# Altium schematic sheet Peripherals.SchDoc: Peripherals
size A4; Date: 9/24/2014; Author: P.A.; CompanyName: STMicroelectronics; Organization: Microcontrollers Division; Address1: 12, Rue Jules HOROWITZ; Address2: 38019 Grenoble; Address3: FRANCE; DocumentNumber: MB1189; Revision: B-07; SheetNumber: 5; SheetTotal: 12; Project: STM32F469I-DISCO
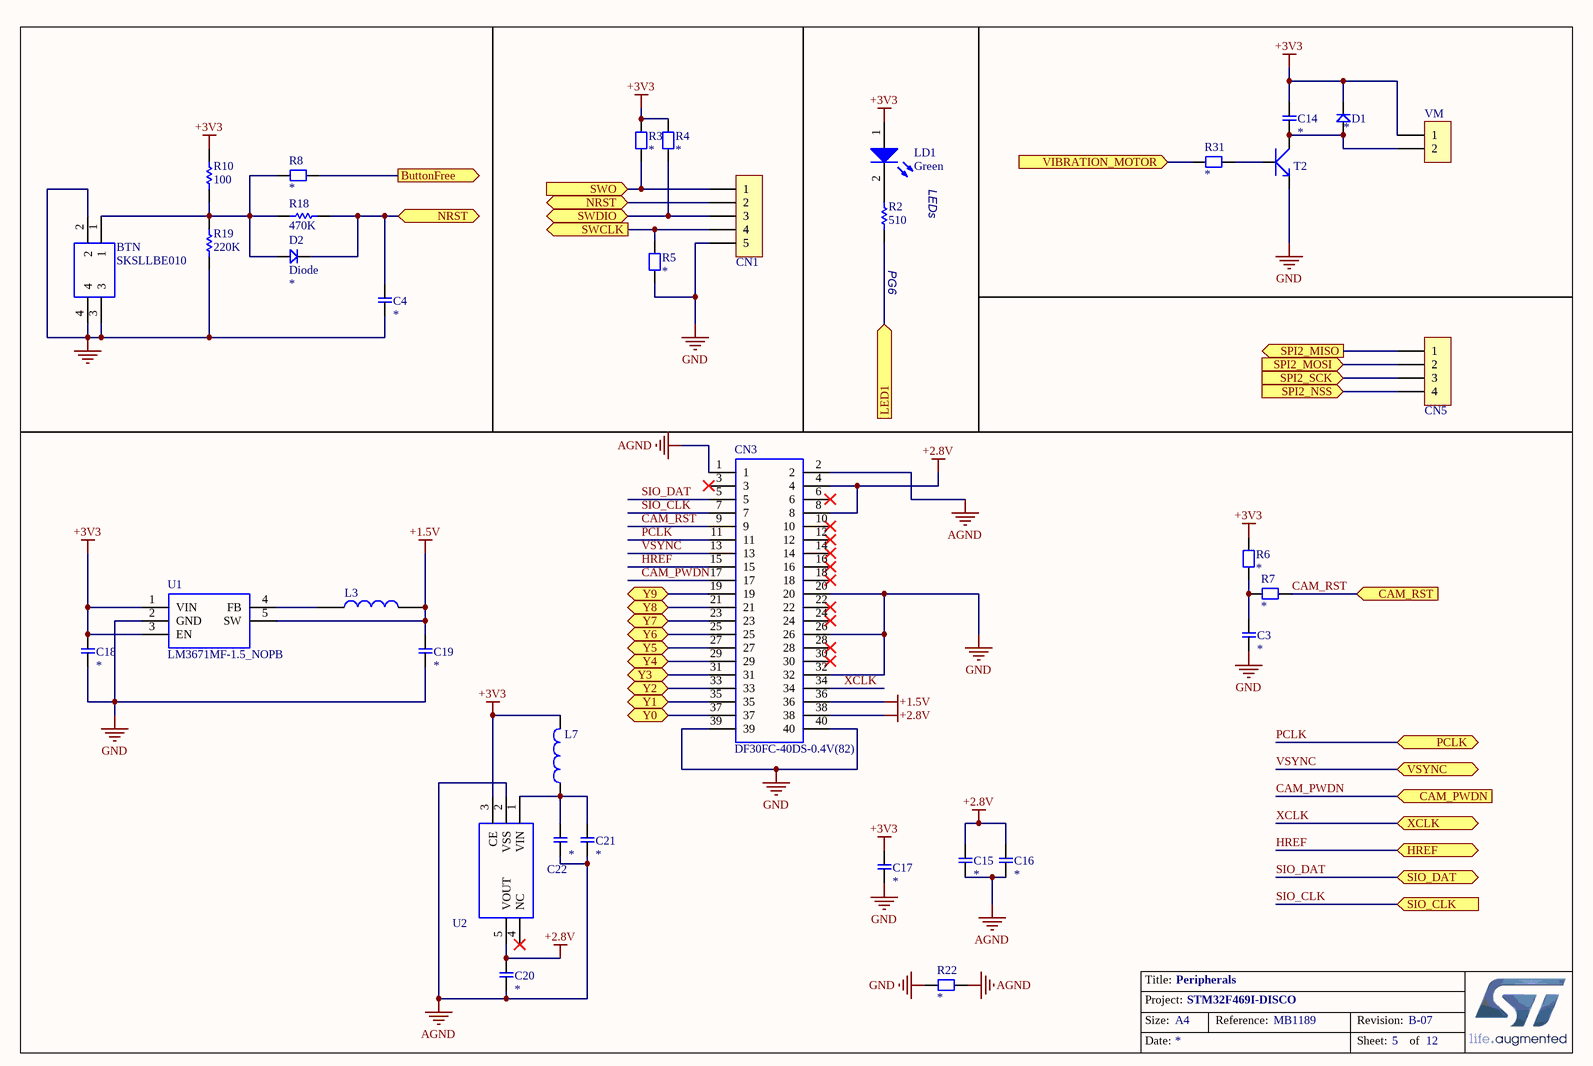
[diagram p0: Peripherals.SchDoc]

## Parts
BTN  SKSLLBE010  [SKSLLBE010]
C3  100 nF  [CAP - 0402]  (value not drawn)
C4  10uF  [CAP - 0805]  (value not drawn)
C14  100nF  [CAP - 0402]  (value not drawn)
C15  100nF  [CAP - 0402]  (value not drawn)
C16  100nF  [CAP - 0402]  (value not drawn)
C17  100nF  [CAP - 0402]  (value not drawn)
C18  4.7 uF  [CAP - 0603]  (value not drawn)
C19  10 uF  [CAP - 0402]  (value not drawn)
C20  1uF  [CAP - 0402]  (value not drawn)
C21  100nF  [CAP - 0402]  (value not drawn)
C22  10uF  [CAP - 0402]  (value not drawn)
CN1  Pin header 5p  [PIN HEADER 5P 2.54mm]  (value not drawn)
CN3  DF30FC-40DS-0.4V(82)  [DF30FC40DS04V82]
CN5  Pin header 4p  [Pin header 4p 1.27mm]  (value not drawn)
D1  Diode  [SOD123]  (value not drawn)
D2  Diode  [SOD123]
L3  2.2uH  [INDPM4532X280N]  (value not drawn)
L7  BEAD(BK1608HS600-T)  [1608[0603]]  (value not drawn)
LD1  Green  [LEDC1608X55N]
R2  510  [RES - 0402]
R3  4K7  [RES - 0402]  (value not drawn)
R4  4K7  [RES - 0402]  (value not drawn)
R5  47K  [RES - 0402]  (value not drawn)
R6  4K7  [RES - 0402]  (value not drawn)
R7  0R  [RES - 0402]  (value not drawn)
R8  10  [RES - 0402]  (value not drawn)
R10  100  [RES - 0402]
R18  470K  [RES - 0603]
R19  220K  [RES - 0402]
R22  0R  [RES - 0402]  (value not drawn)
R31  1K  [RES - 0402]  (value not drawn)
T2  BC817  [SOT23]  (value not drawn)
U1  LM3671MF-1.5_NOPB  [SOT95P280X145-5N]
U2  AP7365-28WG-7DICT-ND  [SOT95P280X120-5N]  (value not drawn)
VM  Pin header 2p  [RES - 0603]  (value not drawn)

## Ports
ButtonFree (out), CAM_PWDN (in), CAM_RST (in), HREF, LED1 (in), NRST (bidir), PCLK, SIO_CLK (in), SIO_DAT (bidir), SPI2_MISO (out), SPI2_MOSI (in), SPI2_NSS (in), SPI2_SCK (in), SWCLK (out), SWDIO (bidir), SWO (in), VIBRATION_MOTOR (in), VSYNC, XCLK, Y0, Y1, Y2, Y3, Y4, Y5, Y6, Y7, Y8, Y9

## Nets
+1.5V: C19.2 CN3.36 L3.2 U1.5(SW)
+2.8V: C15.1 C16.1 C20.1 CN3.4 CN3.8 CN3.38 U2.5(VOUT)
+3V3: C14.2 C17.1 C18.2 D1.2 L7.2 LD1.1(A) R3.2 R4.2 R6.2 R10.2 U1.1(VIN) U1.3(EN) U2.3(CE) VM.1
AGND: C15.2 C16.2 C20.2 C21.2 C22.2 CN3.1 CN3.2 R22.1 U2.2(VSS)
GND: BTN.2 BTN.3 BTN.4 C3.2 C4.1 C17.2 C18.1 C19.1 CN1.5 CN3.20 CN3.26 CN3.32 CN3.39 CN3.40 R5.1 R19.2 R22.2 T2.2 U1.2(GND)
ButtonFree: R8.2 ; port ButtonFree
CAM_PWDN: CN3.17 ; port CAM_PWDN
CAM_RST: CN3.9 R7.1 ; port CAM_RST
HREF: CN3.15 ; port HREF
LED1: R2.1 ; port LED1
NRST: C4.2 CN1.2 D2.2 R18.2 ; port NRST
PCLK: CN3.11 ; port PCLK
SIO_CLK: CN3.7 ; port SIO_CLK
SIO_DAT: CN3.5 ; port SIO_DAT
SPI2_MISO: CN5.1 ; port SPI2_MISO
SPI2_MOSI: CN5.2 ; port SPI2_MOSI
SPI2_NSS: CN5.4 ; port SPI2_NSS
SPI2_SCK: CN5.3 ; port SPI2_SCK
SWCLK: CN1.4 R5.2 ; port SWCLK
SWDIO: CN1.3 R4.1 ; port SWDIO
SWO: CN1.1 R3.1 ; port SWO
VIBRATION_MOTOR: R31.2 ; port VIBRATION_MOTOR
VSYNC: CN3.13 ; port VSYNC
XCLK: CN3.34 ; port XCLK
Y0: CN3.37 ; port Y0
Y1: CN3.35 ; port Y1
Y2: CN3.33 ; port Y2
Y3: CN3.31 ; port Y3
Y4: CN3.29 ; port Y4
Y5: CN3.27 ; port Y5
Y6: CN3.25 ; port Y6
Y7: CN3.23 ; port Y7
Y8: CN3.21 ; port Y8
Y9: CN3.19 ; port Y9
NetBTN_1: BTN.1 D2.1 R8.1 R10.1 R18.1 R19.1
NetC3_1: C3.1 R6.1 R7.2
NetC14_1: C14.1 D1.1 T2.3 VM.2
NetC21_1: C21.1 C22.1 L7.1 U2.1(VIN)
NetL3_1: L3.1 U1.4(FB)
NetLD1_2: LD1.2(K) R2.2
NetR31_1: R31.1 T2.1

Not connected (* = marked no-connect by the designer): CN3 3* 6* 10* 12* 14* 16* 18* 22* 24* 28* 30*; U2 4(NC)*

## Notes on the sheet
- LEDs
- (near R2) PG6
- Title:
- Project:
- Size:
- Date:
- A4
- Reference:
- Sheet:
- Revision:
- of

## Library data of the parts
BTN = SKSLLBE010: Black Button Tactile Switch, SPST-NO 50 mA 0.5mm Surface Mount; Manufacturer_Name: ALPS; Geometry.Height: 2mm; Mouser Part Number: 688-SKSLLBE010; Manufacturer_Part_Number: SKSLLBE010; Datasheet Link: https://componentsearchengine.com/Datasheets/1/SKSLLBE010.pdf
C3 C4 C14-C22 = capacitor: Parameter 1: *; Parameter 2: *; Value: *
CN3 = DF30FC-40DS-0.4V(82): Hirose DF30 Series 0.4mm 40 Way 2 Row Straight PCB Socket Surface Mount Board to Board, Board to FPC; Geometry.Height: 1.05mm; Manufacturer_Name: Hirose; Manufacturer_Part_Number: DF30FC-40DS-0.4V(82); RS Part Number: 7008159; RS Price/Stock: http://uk.rs-online.com/web/p/products/7008159; Arrow Part Number: DF30FC-40DS-0.4V(82); Arrow Price/Stock: http://uk.rs-online.com/web/p/products/7008159; Datasheet Link: https://www.hirose.com/product/en/download_file/key_name/DF30FC-40DS-0.4V%2882%29/category/Drawing%20(2D)/doc_file_id/46399/?file_category_id=6&item_id=06841078682&is_series=
L3 = LQH43CN100K03L: 587-3550-1-ND; Manufacturer_Name: Murata Electronics; Geometry.Height: 2.8mm; Manufacturer_Part_Number: LQH43CN100K03L; RS Part Number: 7255165P; RS Price/Stock: http://uk.rs-online.com/web/p/products/7255165P; Arrow Part Number: LQH43CN100K03L; Arrow Price/Stock: https://www.arrow.com/en/products/lqh43cn100k03l/murata-manufacturing; Datasheet Link: http://search.murata.co.jp/Ceramy/image/img/PDF/ENG/L0075S0093LQH43C_03.pdf
L7 = Inductor: Code_IEC: 1005; Value: 10mH; Published: 8-Jun-2000; LatestRevisionDate: 29-May-2009; LatestRevisionNote: IPC-7351 Footprint Added.; PackageReference: 0402-A; Publisher: Altium Limited; PackageDescription: Chip Inductor; Code_JEITA: 0402
LD1 = LED2: Typical RED, GREEN, YELLOW, AMBER GaAs LED; Ordered by: Subcon; ECCN_US/EU: EAR99/NEC; Published: 8-Jun-2000; Revision: July-2002: Re-released for DXP Platform.; Publisher: Altium Limited
R2 R10 R18 = Res1: Resistor; Value: 1K; Ordered by: Subcon; Published: 8-Jun-2000; Revision: July-2002: Re-released for DXP Platform.; Publisher: Altium Limited
R3-R8 R22 R31 = resistor: Parameter 1: *; Parameter 2: *; Value: *
R19 = res1: Resistor; Value: 1K; Ordered by: Subcon; Published: 8-Jun-2000; Revision: July-2002: Re-released for DXP Platform.; Publisher: Altium Limited
U1 = LM3671MF-1.5_NOPB: 2MHz, 600mA Step-Down DC-DC Converter; Manufacturer_Name: Texas Instruments; Manufacturer_Part_Number: LM3671MF-1.5/NOPB; Geometry.Height: 1.45mm; RS Part Number: 1624720; RS Price/Stock: http://uk.rs-online.com/web/p/products/1624720; Arrow Part Number: LM3671MF-1.5/NOPB; Arrow Price/Stock: https://www.arrow.com/en/products/lm3671mf-1.5nopb/texas-instruments; Datasheet Link: http://www.ti.com/lit/ds/symlink/lm3671.pdf
U2 = XC6210B302MR-G: LDO Voltage Regulators 700mA High Speed Votage Regulator; Manufacturer_Name: Torex; Geometry.Height: 1.2mm; Manufacturer_Part_Number: XC6210B302MR-G; RS Part Number: *; RS Price/Stock: *; Arrow Part Number: XC6210B302MR-G; Arrow Price/Stock: *; Datasheet Link: https://componentsearchengine.com/Datasheets/1/XC6210B302MR-G.pdf
D1 D2 = Diode: Type: *